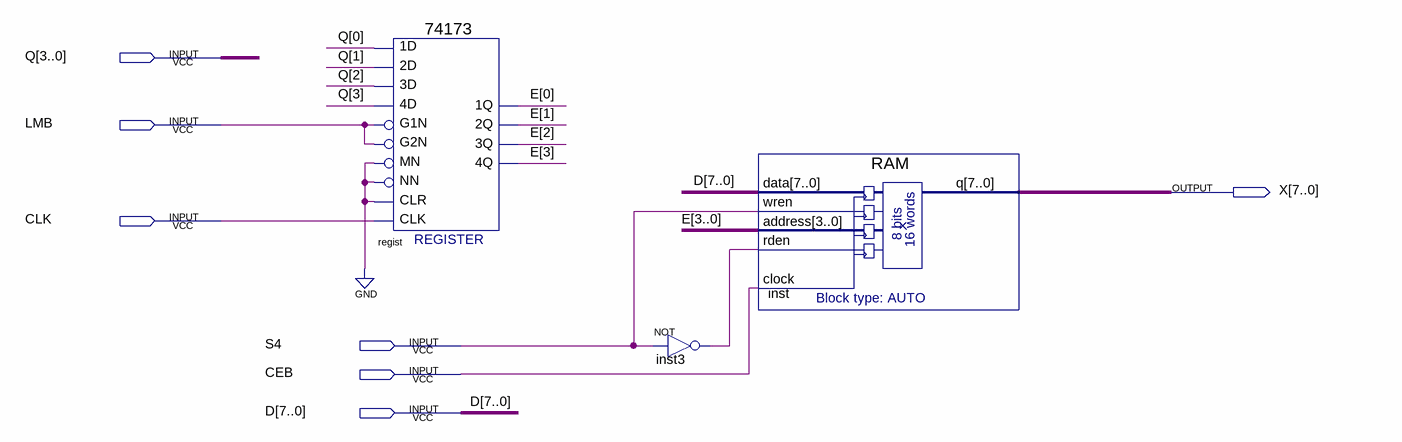
[diagram p0: schematic sheet]
// Quartus schematic Unidade_de_Memoria.bdf as structural Verilog: 3 symbols, 7 pins
module Unidade_de_Memoria (
  input  [3:0] Q,
  input  LMB,
  input  CLK,
  input  S4,
  input  CEB,
  input  [7:0] D,
  output [7:0] X
);

  wire inst3_out;
  wire [3:0] E;

  \74173  regist (
    .\3D (Q[2]), .MN(1'b0), .\1D (Q[0]), .\2D (Q[1]), .\4D (Q[3]), .G1N(LMB), .G2N(LMB), .NN(1'b0),
    .CLR(1'b0), .CLK(CLK), .\3Q (E[2]), .\2Q (E[1]), .\1Q (E[0]), .\4Q (E[3]));
  not inst3 (inst3_out, S4);
  RAM inst (.data(D), .wren(S4), .address(E), .rden(inst3_out), .clock(CEB), .q(X));
endmodule
